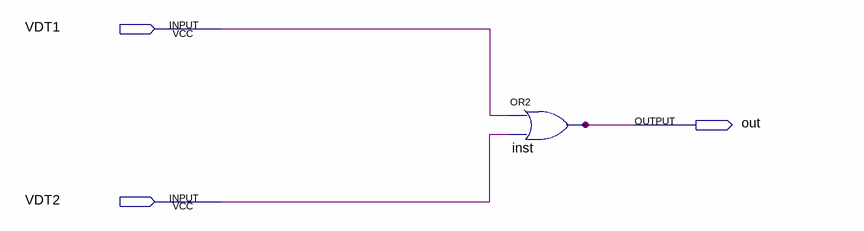
[diagram p0: schematic sheet]
// Quartus schematic assignment2.bdf as structural Verilog: 1 symbols, 3 pins
module assignment2 (
  input  VDT1,
  input  VDT2,
  output out
);

  or inst (out, VDT1, VDT2);
endmodule
